# Altium schematic sheet 5_ZynTra-Zynq-PL.SchDoc
size 304 x 228 mm; SheetNumber: 5; SheetTotal: 10
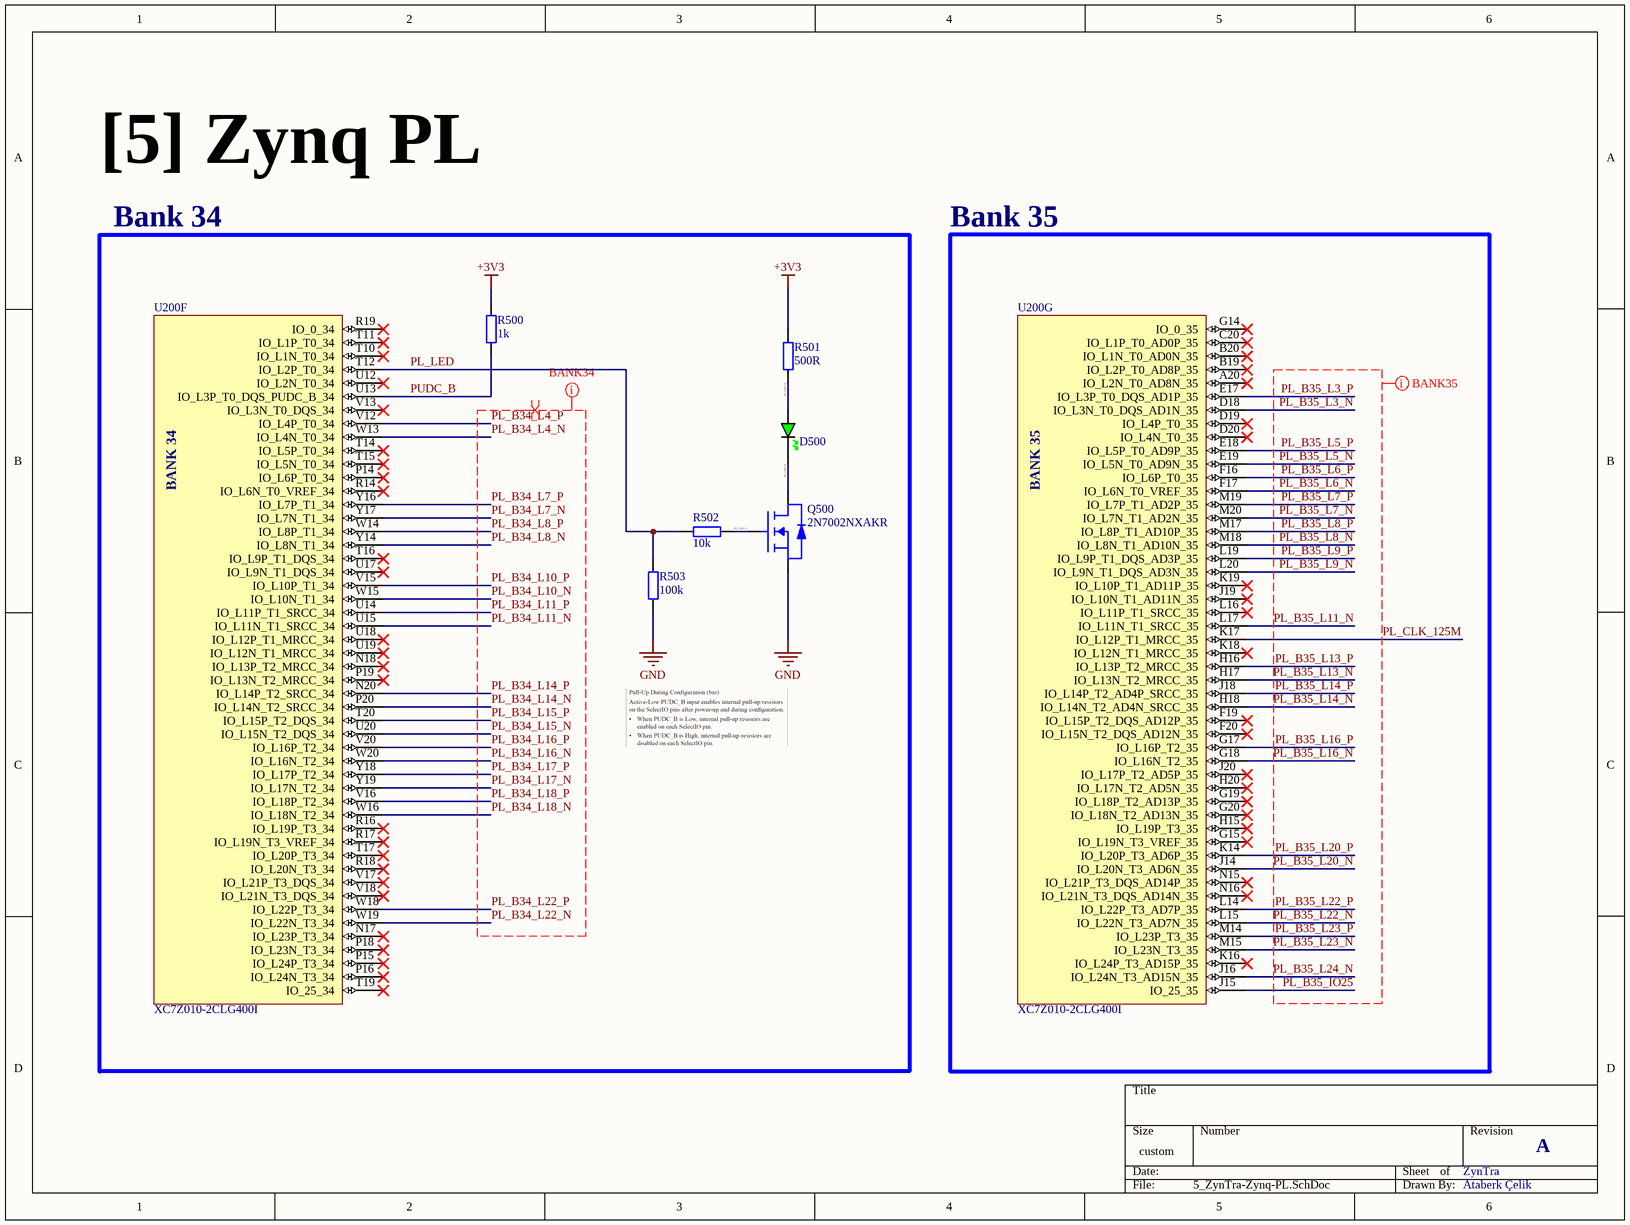
[diagram p0: 5_ZynTra-Zynq-PL.SchDoc]

## Parts
D500  GREEN  [LED_0603_GREEN]  (value not drawn)
Q500  2N7002NXAKR  [SSM3J338R,LF-SOT23-F]
R500  1k  [RES_0402]
R501  500R  [RES_0402]
R502  10k  [RES_0402]
R503  100k  [RES_0402]
U200  XC7Z010-2CLG400I  [CLG400, 0.8mm, 17x17]  (parts F,G of 9)

## Blocks framed on the sheet
Bank 34: D500 Q500 R500-R503 U200
Bank 35: U200

## Nets
+3V3: R500.1 R501.1
GND: Q500.S R503.2
PL_B34_L4_N: U200.W13(IO_L4N_T0_34)
PL_B34_L4_P: U200.V12(IO_L4P_T0_34)
PL_B34_L7_N: U200.Y17(IO_L7N_T1_34)
PL_B34_L7_P: U200.Y16(IO_L7P_T1_34)
PL_B34_L8_N: U200.Y14(IO_L8N_T1_34)
PL_B34_L8_P: U200.W14(IO_L8P_T1_34)
PL_B34_L10_N: U200.W15(IO_L10N_T1_34)
PL_B34_L10_P: U200.V15(IO_L10P_T1_34)
PL_B34_L11_N: U200.U15(IO_L11N_T1_SRCC_34)
PL_B34_L11_P: U200.U14(IO_L11P_T1_SRCC_34)
PL_B34_L14_N: U200.P20(IO_L14N_T2_SRCC_34)
PL_B34_L14_P: U200.N20(IO_L14P_T2_SRCC_34)
PL_B34_L15_N: U200.U20(IO_L15N_T2_DQS_34)
PL_B34_L15_P: U200.T20(IO_L15P_T2_DQS_34)
PL_B34_L16_N: U200.W20(IO_L16N_T2_34)
PL_B34_L16_P: U200.V20(IO_L16P_T2_34)
PL_B34_L17_N: U200.Y19(IO_L17N_T2_34)
PL_B34_L17_P: U200.Y18(IO_L17P_T2_34)
PL_B34_L18_N: U200.W16(IO_L18N_T2_34)
PL_B34_L18_P: U200.V16(IO_L18P_T2_34)
PL_B34_L22_N: U200.W19(IO_L22N_T3_34)
PL_B34_L22_P: U200.W18(IO_L22P_T3_34)
PL_B35_IO25: U200.J15(IO_25_35)
PL_B35_L3_N: U200.D18(IO_L3N_T0_DQS_AD1N_35)
PL_B35_L3_P: U200.E17(IO_L3P_T0_DQS_AD1P_35)
PL_B35_L5_N: U200.E19(IO_L5N_T0_AD9N_35)
PL_B35_L5_P: U200.E18(IO_L5P_T0_AD9P_35)
PL_B35_L6_N: U200.F17(IO_L6N_T0_VREF_35)
PL_B35_L6_P: U200.F16(IO_L6P_T0_35)
PL_B35_L7_N: U200.M20(IO_L7N_T1_AD2N_35)
PL_B35_L7_P: U200.M19(IO_L7P_T1_AD2P_35)
PL_B35_L8_N: U200.M18(IO_L8N_T1_AD10N_35)
PL_B35_L8_P: U200.M17(IO_L8P_T1_AD10P_35)
PL_B35_L9_N: U200.L20(IO_L9N_T1_DQS_AD3N_35)
PL_B35_L9_P: U200.L19(IO_L9P_T1_DQS_AD3P_35)
PL_B35_L11_N: U200.L17(IO_L11N_T1_SRCC_35)
PL_B35_L13_N: U200.H17(IO_L13N_T2_MRCC_35)
PL_B35_L13_P: U200.H16(IO_L13P_T2_MRCC_35)
PL_B35_L14_N: U200.H18(IO_L14N_T2_AD4N_SRCC_35)
PL_B35_L14_P: U200.J18(IO_L14P_T2_AD4P_SRCC_35)
PL_B35_L16_N: U200.G18(IO_L16N_T2_35)
PL_B35_L16_P: U200.G17(IO_L16P_T2_35)
PL_B35_L20_N: U200.J14(IO_L20N_T3_AD6N_35)
PL_B35_L20_P: U200.K14(IO_L20P_T3_AD6P_35)
PL_B35_L22_N: U200.L15(IO_L22N_T3_AD7N_35)
PL_B35_L22_P: U200.L14(IO_L22P_T3_AD7P_35)
PL_B35_L23_N: U200.M15(IO_L23N_T3_35)
PL_B35_L23_P: U200.M14(IO_L23P_T3_35)
PL_B35_L24_N: U200.J16(IO_L24N_T3_AD15N_35)
PL_CLK_125M: U200.K17(IO_L12P_T1_MRCC_35)
PL_LED: R502.1 R503.1 U200.T12(IO_L2P_T0_34)
PL_LED_A: D500.A R501.2
PL_LED_G: Q500.G R502.2
PL_LED_K: D500.K Q500.D
PUDC_B: R500.2 U200.U13(IO_L3P_T0_DQS_PUDC_B_34)

Not connected (* = marked no-connect by the designer): U200 A20(IO_L2N_T0_AD8N_35)* B19(IO_L2P_T0_AD8P_35)* B20(IO_L1N_T0_AD0N_35)* C20(IO_L1P_T0_AD0P_35)* D19(IO_L4P_T0_35)* D20(IO_L4N_T0_35)* F19(IO_L15P_T2_DQS_AD12P_35)* F20(IO_L15N_T2_DQS_AD12N_35)* G14(IO_0_35)* G15(IO_L19N_T3_VREF_35)* G19(IO_L18P_T2_AD13P_35)* G20(IO_L18N_T2_AD13N_35)* H15(IO_L19P_T3_35)* H20(IO_L17N_T2_AD5N_35)* J19(IO_L10N_T1_AD11N_35)* J20(IO_L17P_T2_AD5P_35)* K16(IO_L24P_T3_AD15P_35)* K18(IO_L12N_T1_MRCC_35)* K19(IO_L10P_T1_AD11P_35)* L16(IO_L11P_T1_SRCC_35)* N15(IO_L21P_T3_DQS_AD14P_35)* N16(IO_L21N_T3_DQS_AD14N_35)* N17(IO_L23P_T3_34)* N18(IO_L13P_T2_MRCC_34)* P14(IO_L6P_T0_34)* P15(IO_L24P_T3_34)* P16(IO_L24N_T3_34)* P18(IO_L23N_T3_34)* P19(IO_L13N_T2_MRCC_34)* R14(IO_L6N_T0_VREF_34)* R16(IO_L19P_T3_34)* R17(IO_L19N_T3_VREF_34)* R18(IO_L20N_T3_34)* R19(IO_0_34)* T10(IO_L1N_T0_34)* T11(IO_L1P_T0_34)* T14(IO_L5P_T0_34)* T15(IO_L5N_T0_34)* T16(IO_L9P_T1_DQS_34)* T17(IO_L20P_T3_34)* T19(IO_25_34)* U12(IO_L2N_T0_34)* U17(IO_L9N_T1_DQS_34)* U18(IO_L12P_T1_MRCC_34)* U19(IO_L12N_T1_MRCC_34)* V13(IO_L3N_T0_DQS_34)* V17(IO_L21P_T3_DQS_34)* V18(IO_L21N_T3_DQS_34)*

## Layout directives
net class BANK35: PL_B35_IO25, PL_B35_L3_N, PL_B35_L3_P, PL_B35_L5_N, PL_B35_L5_P, PL_B35_L6_N, PL_B35_L6_P, PL_B35_L7_N, PL_B35_L7_P, PL_B35_L8_N, PL_B35_L8_P, PL_B35_L9_N, PL_B35_L9_P, PL_B35_L11_N, PL_B35_L13_N, PL_B35_L13_P, PL_B35_L14_N, PL_B35_L14_P, PL_B35_L16_N, PL_B35_L16_P, PL_B35_L20_N, PL_B35_L20_P, PL_B35_L22_N, PL_B35_L22_P, PL_B35_L23_N, PL_B35_L23_P, PL_B35_L24_N
net class BANK34; rule Matched Net Lengths [Delay Tolerance = 10ps]: PL_B34_L4_N, PL_B34_L4_P, PL_B34_L7_N, PL_B34_L7_P, PL_B34_L8_N, PL_B34_L8_P, PL_B34_L10_N, PL_B34_L10_P, PL_B34_L11_N, PL_B34_L11_P, PL_B34_L14_N, PL_B34_L14_P, PL_B34_L15_N, PL_B34_L15_P, PL_B34_L16_N, PL_B34_L16_P, PL_B34_L17_N, PL_B34_L17_P, PL_B34_L18_N, PL_B34_L18_P, PL_B34_L22_N, PL_B34_L22_P
differential pair: PL_B34_L4_N, PL_B34_L4_P, PL_B34_L7_N, PL_B34_L7_P, PL_B34_L8_N, PL_B34_L8_P, PL_B34_L10_N, PL_B34_L10_P, PL_B34_L11_N, PL_B34_L11_P, PL_B34_L14_N, PL_B34_L14_P, PL_B34_L15_N, PL_B34_L15_P, PL_B34_L16_N, PL_B34_L16_P, PL_B34_L17_N, PL_B34_L17_P, PL_B34_L18_N, PL_B34_L18_P, PL_B34_L22_N, PL_B34_L22_P

## Notes on the sheet
- [5] Zynq PL
- ZynTra
- A
- Ataberk Çelik
- (in symbol XC7Z010-2CLG400I, part F) BANK 34
- (in symbol XC7Z010-2CLG400I, part G) BANK 35

## Library data of the parts
D500 = LED_0603_GREEN: LED 0603 GREEN SMD
Q500 = 2N7002NXAKR: MOSFET N-Channel Vds=60V Id=300mA with ESD Protection; Manufacturer: Nexperia; Manufacturer Part Number: 2N7002NXAKR
R500-R503 = RES_0402: Resistor SMD 0402; Manufacturer: *; Manufacturer Part Number: *; Distributor Link: *; LCSC: *
U200 = XC7Z010-2CLG400I: Zynq 7000S SoC devices feature a single-core Arm® Cortex®-A9 processor mated with 28 nm AMD Artix™ 7 based programmable logic, representing a low cost entry point to the scalable Zynq 7000 platform. Available with 6.25 Gb/s transceivers and outfitted with commonly used hardened peripherals, the Zynq 7000S delivers cost-optimized system integration ideal for industrial IoT applications such as motor control and embedded vision.; Manufacturer: AMD / Xilinx; Manufacturer Part Number: XC7Z010-2CLG400I; Supplier Link: https://www.mouser.com.tr/ProductDetail/AMD-Xilinx/XC7Z010-2CLG400I?qs=rrS6PyfT74cETvLeyRFHTA%3D%3D